# EAGLE design BlankSlate (EAGLE 7.3.0)
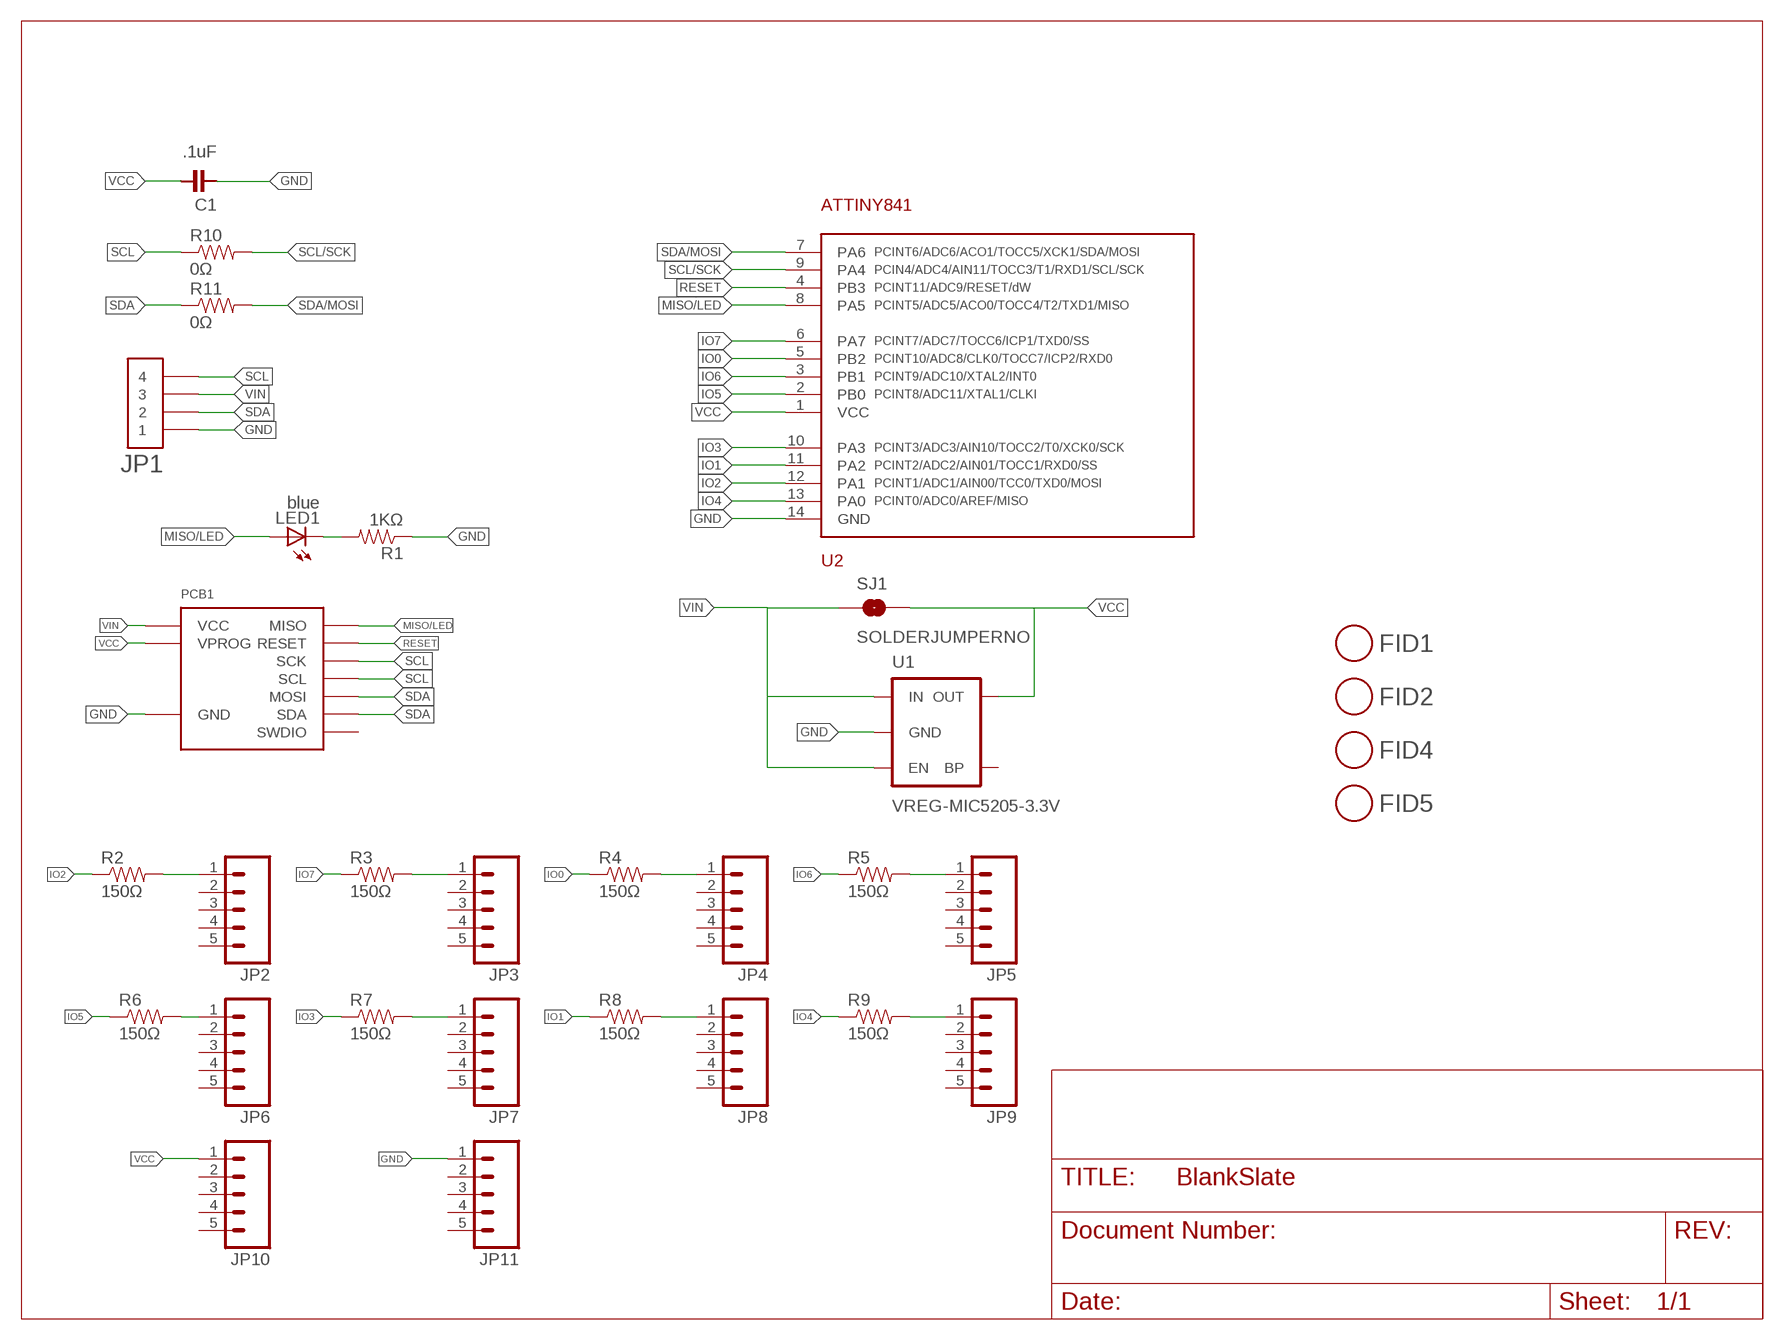
[diagram p0: schematic, sheet 1]
FRAME1 (LETTER_L): BOM: EXCLUDE

## Parts
C1  .1uF  CAPACITOR-.1UF  [0603]
FID1  FIDUCIAL  [FIDUCIAL_1MM]
FID2  FIDUCIAL  [FIDUCIAL_1MM]
FID4  FIDUCIAL  [FIDUCIAL_1MM]
FID5  FIDUCIAL  [FIDUCIAL_1MM]
JP1  HEADER-1X4-AMPMODU  [AMPMODU-4P]
JP2  M05NO_SILK  [1X05_NO_SILK]
JP3  M05NO_SILK  [1X05_NO_SILK]
JP4  M05NO_SILK  [1X05_NO_SILK]
JP5  M05NO_SILK  [1X05_NO_SILK]
JP6  M05NO_SILK  [1X05_NO_SILK]
JP7  M05NO_SILK  [1X05_NO_SILK]
JP8  M05NO_SILK  [1X05_NO_SILK]
JP9  M05NO_SILK  [1X05_NO_SILK]
JP10  M05NO_SILK  [1X05_NO_SILK]
JP11  M05NO_SILK  [1X05_NO_SILK]
LED1  blue  LED-0805-BLUE  [0805-LED]
PCB1  DEVICE-PCB  [DEVICE-PCB]
R1  1KΩ  RESISTOR-1KΩ  [0603]
R2  150Ω  RESISTOR-150Ω  [0603]
R3  150Ω  RESISTOR-150Ω  [0603]
R4  150Ω  RESISTOR-150Ω  [0603]
R5  150Ω  RESISTOR-150Ω  [0603]
R6  150Ω  RESISTOR-150Ω  [0603]
R7  150Ω  RESISTOR-150Ω  [0603]
R8  150Ω  RESISTOR-150Ω  [0603]
R9  150Ω  RESISTOR-150Ω  [0603]
R10  0Ω  RESISTOR-0Ω  [0603]
R11  0Ω  RESISTOR-0Ω  [0603]
SJ1  SOLDERJUMPERNO  [SJ_2S-NO]
U1  VREG-MIC5205-3.3V  [SOT23-5]
U2  ATTINY841  [SOIC-14]

## Nets
GND: C1.2 JP1.P$1 JP1.P$2 JP11.1 PCB1.GND R1.1 U1.2(GND) U2.14(GND)
IO0: R4.1 U2.5(PB2)
IO1: R8.1 U2.11(PA2)
IO2: R2.1 U2.12(PA1)
IO3: R7.1 U2.10(PA3)
IO4: R9.1 U2.13(PA0)
IO5: R6.1 U2.2(PB0)
IO6: R5.1 U2.3(PB1)
IO7: R3.1 U2.6(PA7)
MISO/LED: LED1.A PCB1.MISO U2.8(PA5)
N$3: JP4.1 R4.2
N$4: JP5.1 R5.2
N$5: JP7.1 R7.2
N$6: JP2.1 R2.2
N$7: JP3.1 R3.2
N$8: JP6.1 R6.2
N$9: JP9.1 R9.2
N$10: LED1.C R1.2
N$12: JP8.1 R8.2
RESET: PCB1.RESET U2.4(PB3)
SCL: JP1.P$7 JP1.P$8 PCB1.CLK(SCK) PCB1.SCL R10.1
SCL/SCK: R10.2 U2.9(PA4)
SDA: JP1.P$3 JP1.P$4 PCB1.MOSI PCB1.SDA R11.1
SDA/MOSI: R11.2 U2.7(PA6)
VCC: C1.1 JP10.1 PCB1.VPROG SJ1.2 U1.5(OUT) U2.1(VCC)
VIN: JP1.P$5 JP1.P$6 PCB1.VCC SJ1.1 U1.1(IN) U1.3(EN)
Unconnected: JP2.2 JP2.3 JP2.4 JP2.5 JP3.2 JP3.3 JP3.4 JP3.5 JP4.2 JP4.3 JP4.4 JP4.5 JP5.2 JP5.3 JP5.4 JP5.5 JP6.2 JP6.3 JP6.4 JP6.5 JP7.2 JP7.3 JP7.4 JP7.5 JP8.2 JP8.3 JP8.4 JP8.5 JP9.2 JP9.3 JP9.4 JP9.5 JP10.2 JP10.3 JP10.4 JP10.5 JP11.2 JP11.3 JP11.4 JP11.5 PCB1.SWDIO U1.4(BP)

## Library data of the parts
C1 = Modulo:CAPACITOR: Capacitor; PARTNUM: C0603C104K5RACTU
FID1 FID2 FID4 FID5 = Modulo:FIDUCIAL; BOM: EXCLUDE
JP1 = Modulo:HEADER-1X4; PARTNUM: 147721-3
JP2-JP11 = SparkFun-Connectors:M05: Header 5 Standard 5-pin 0.1" header. Use with straight break away headers (SKU : PRT-00116), right angle break away headers (PRT-00553), swiss pins (PRT-00743), machine pins (PRT-00117), and female headers (PRT-00115). Molex polarized connector foot print use with SKU : PRT-08230 with associated crimp pins and housings.; PARTNUM: EXCLUDE
LED1 = Modulo:LED: LED; PARTNUM: LTST-C171TBKT
PCB1 = Modulo:DEVICE-PCB: Modulo Footprint; PARTNUM: Blank Slate PCB
R1 = Modulo:RESISTOR: Resistor Basic schematic elements and footprints for 0603, 1206, and PTH resistors.; PARTNUM: ERJ-3EKF1001V
R2-R9 = Modulo:RESISTOR: Resistor Basic schematic elements and footprints for 0603, 1206, and PTH resistors.; PARTNUM: ERJ-3EKF1500V
R10 R11 = Modulo:RESISTOR: Resistor Basic schematic elements and footprints for 0603, 1206, and PTH resistors.; PARTNUM: ERJ-3GEY0R00V
SJ1 = SparkFun-Passives:SOLDERJUMPER: Solder Jumper Standard SMD solder jumper. Used to automate production. Two varients : Normally Open and Normally Closed are the same, but have different paste layers. NC will have a large amount of paste and should jumper during reflow.; BOM: EXCLUDE
U1 = Modulo:VREG-MIC5205: V_REG MIC5219 Standard 3.3V and 5V 150mA LDO voltage regulator in SOT-23 layout. Micrel part MIC5205. BP (by-pass) pin is used to lower output noise with 470pF cap, may be left open.; PARTNUM: MIC5205-3.3YM5 TR
U2 = Modulo:ATTINY841; PARTNUM: ATTINY841-SSUR

## Board
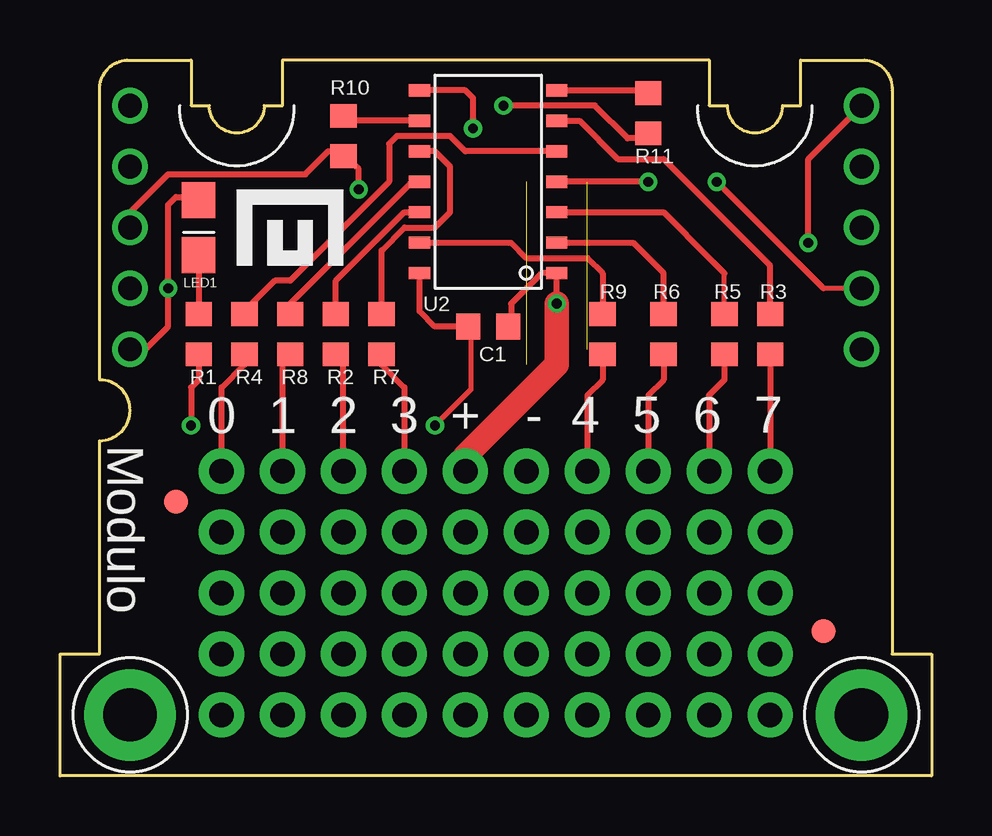
[diagram p1: board, top side]
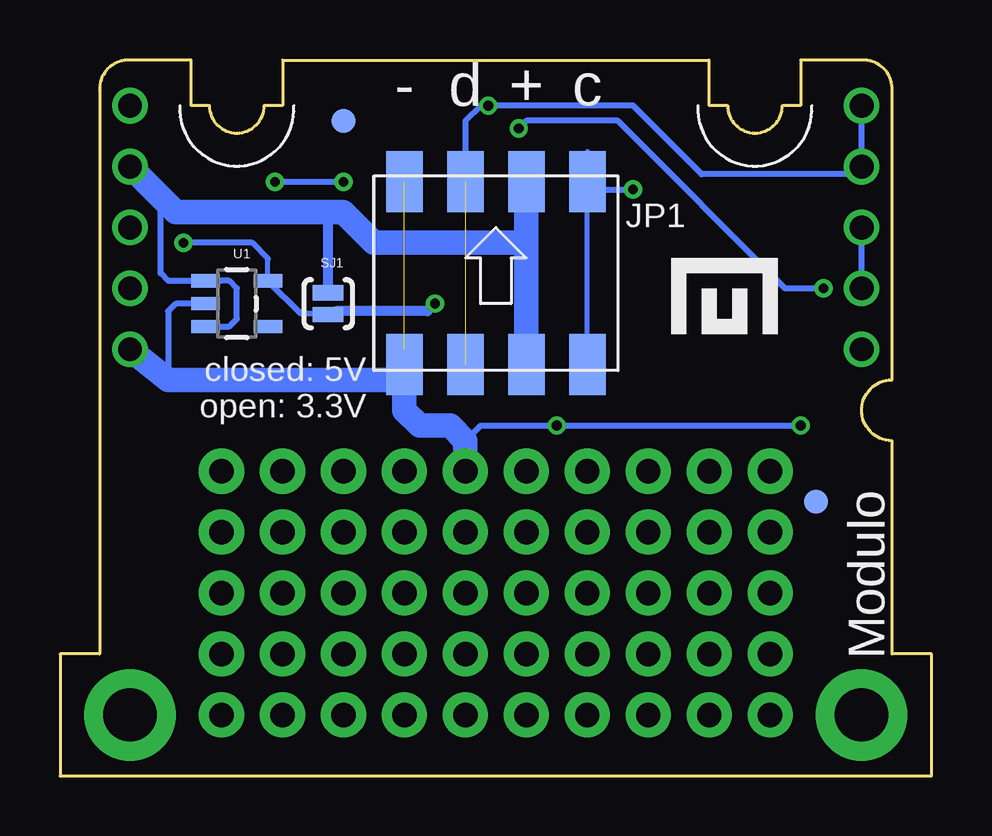
[diagram p2: board, bottom side, seen from below]

Size 36.32 x 29.84 mm. Coordinates in mm from the lower left corner, seen from the top.
Copper layers (1*16): Top 0.0356mm / dielectric 1.5011mm / Bottom 0.0356mm
Design rules "Modulo": minimum track width 6mil, minimum drill 13mil, track to track 6mil, track to pad 6mil, pad to pad 6mil, via to via 6mil, smd to smd 6mil, copper to edge 15mil, drill to drill 6mil, minimum pad ring 7mil, minimum via ring 7mil, stop-mask expansion 3mil, vias tented up to drill 25mil, thermal gap 10mil

### Footprints (pad centres in the part's own frame; a part is rotated, then mirrored left to right if it is on the bottom)
0603 = smd 0.991 x 1.092: 1 -0.838,0; 2 0.838,0
FIDUCIAL_1MM = smd 1 x 1: 1 0,0
AMPMODU-4P = smd 1.524 x 2.54: P$1 -3.81,3.81; P$2 -3.81,-3.81; P$3 -1.27,3.81; P$4 -1.27,-3.81; P$5 1.27,3.81; P$6 1.27,-3.81; P$7 3.81,3.81; P$8 3.81,-3.81
1X05_NO_SILK = drill 1.016 pad 1.88: 1 0,0; 2 2.54,0; 3 5.08,0; 4 7.62,0; 5 10.16,0
0805-LED = smd 1.397 x 1.499: A 0,-1.143; C 0,1.143
DEVICE-PCB = drill 0.991: CLK 2.54,20.32; GND 33.02,17.78; MISO 2.54,17.78; MOSI 2.54,25.4; RESET 33.02,20.32; SCL 2.54,22.86; SDA 2.54,27.94; SWDIO 33.02,22.86; VCC 33.02,25.4; VPROG 33.02,27.94 | drill 2.223 pad 3.81: P$1 2.54,2.54; P$2 33.02,2.54
SJ_2S-NO = smd 0.635 x 1.27: 1 -0.45,0; 2 0.45,0
SOT23-5 = smd 0.55 x 1.2: 1 -0.95,-1.3; 2 0,-1.3; 3 0.95,-1.3; 4 0.95,1.3; 5 -0.95,1.3
SOIC-14 = smd 0.508 x 0.889: 1 0,-3.175; 2 1.27,-3.175; 3 2.54,-3.175; 4 3.81,-3.175; 5 5.08,-3.175; 6 6.35,-3.175; 7 7.62,-3.175; 8 7.62,2.54; 9 6.35,2.54; 10 5.08,2.54; 11 3.81,2.54; 12 2.54,2.54; 13 1.27,2.54; 14 0,2.54

### Placement (x,y rotation side)
C1  17.84,18.73 180 top
FID1  31.81,6.03 90 top
FID2  4.83,11.43 0 top
FID4  24.51,27.3 0 bottom
FID5  4.83,11.43 0 bottom
JP1  18.16,20.95 0 bottom
JP2  11.81,12.7 270 bottom
JP3  29.59,12.7 270 bottom
JP4  6.73,12.7 270 bottom
JP5  27.05,12.7 270 bottom
JP6  24.51,12.7 270 bottom
JP7  14.35,12.7 270 bottom
JP8  9.27,12.7 270 bottom
JP9  21.97,12.7 270 bottom
JP10  16.89,12.7 270 bottom
JP11  19.43,12.7 270 bottom
LED1  5.78,22.86 180 top
PCB1  0.38,0 0 top
R1  5.78,18.41 90 top
R2  11.49,18.41 270 top
R3  29.59,18.41 270 top
R4  7.68,18.41 270 top
R5  27.69,18.41 270 top
R6  25.15,18.41 270 top
R7  13.4,18.41 270 top
R8  9.59,18.41 270 top
R9  22.61,18.41 270 top
R10  11.81,26.67 90 top
R11  24.51,27.62 90 top
SJ1  25.15,19.68 270 bottom
U1  28.96,19.68 270 bottom
U2  17.53,20.95 90 top
U$1  [LOGO-SMALL]  8.95,19.05 0 bottom
U$2  [LOGO-SMALL]  9.27,21.91 0 top

### Tracks (layer width: path | path; a pad name or v marks a point on that pad's centre or on a via)
GND  (via drill 0.41)  (1 unrouted)
  Top 0.203: C1.2 17.12,18.7 17.12,16.1 v15.62,14.61
  Top 0.254: C1.2 15.62,18.73 14.99,19.37 U2.14 | R1.1 5.78,16.51 5.46,16.19 v5.46,14.61
  Bottom 0.203: JP1.P$2 21.97,17.78
  Bottom 0.254: v5.46,14.61 v15.62,14.61 18.8,14.61 19.43,13.97 | U1.2 31.5,19.68 31.81,19.37 31.81,16.51
  Bottom 1.016: JP1.P$2 21.97,15.24 21.34,14.61 20.07,14.61 19.43,13.97 JP11.1 | PCB1.GND 31.81,16.51 22.29,16.51 21.97,16.83 21.97,17.78
IO0
  Top 0.203: 7.68,19.37 R4.1
  Top 0.254: U2.5 16.89,26.04 16.26,26.67 14.03,26.67 13.72,26.35 13.72,24.77 9.59,20.64 8.95,20.64 7.68,19.37
IO1
  Top 0.203: U2.11 14.67,24.77 | 9.59,19.68 R8.1
  Top 0.254: 14.67,24.77 9.59,19.68
IO2
  Top 0.254: R2.1 11.49,20.64 14.35,23.5 U2.12
IO3
  Top 0.254: R7.1 13.4,21.91 14.35,22.86 15.62,22.86 16.26,23.5 16.26,25.4 15.62,26.04 U2.10
IO4
  Top 0.254: U2.13 18.8,22.23 19.43,21.59 21.97,21.59 22.61,20.95 R9.1
IO5
  Top 0.254: U2.2 23.88,22.23 25.15,20.95 R6.1
IO6
  Top 0.203: R5.1 27.69,20.95
  Top 0.254: U2.3 25.15,23.5 27.05,21.59 27.69,20.95
IO7
  Top 0.254: U2.6 21.65,27.3 23.24,25.72 25.15,25.72 29.59,21.27 R3.1
MISO/LED  (via drill 0.41)
  Top 0.203: 5.65,24.13 LED1.A
  Top 0.254: v17.21,26.99 17.21,28.26 16.89,28.57 U2.8 | PCB1.MISO 3.56,17.78 4.51,18.73 v4.51,20.32 4.51,23.81 4.83,24.13 5.65,24.13
  Bottom 0.254: v4.51,20.32 6.1,20.32 13.08,27.3 16.89,27.3 v17.21,26.99
N$3
  Top 0.203: 7.68,17.14 R4.2
  Top 0.254: JP4.1 6.73,16.19 7.68,17.14
N$4
  Top 0.254: R5.2 27.69,16.51 27.05,15.88 JP5.1
N$5
  Top 0.254: R7.2 13.4,17.14 14.35,16.19 JP7.1
N$6
  Top 0.203: 11.81,17.46 11.49,17.78 R2.2
  Top 0.254: JP2.1 11.81,17.46
N$7
  Top 0.254: R3.2 JP3.1
N$8
  Top 0.254: R6.2 25.15,16.51 24.51,15.88 JP6.1
N$9
  Top 0.254: R9.2 22.61,16.51 21.97,15.88 JP9.1
N$10
  Top 0.254: LED1.C R1.2
N$12
  Top 0.203: 9.27,17.14 9.59,17.46 R8.2
  Top 0.254: JP8.1 9.27,17.14
RESET  (via drill 0.41)
  Top 0.203: PCB1.RESET 31.81,20.32
  Top 0.254: 31.81,20.32 v27.37,24.77 | v24.51,24.77 U2.4
  Bottom 0.254: v27.37,24.77 v24.51,24.77
SCL  (via drill 0.41)
  Top 0.203: 11.72,26.04 R10.1
  Top 0.254: v12.45,24.45 12.45,25.31 R10.1 | 11.72,26.04 11.18,26.04 10.22,25.08 4.51,25.08 2.92,23.5 PCB1.SCL
  Bottom 0.203: JP1.P$7 14.03,24.45 | JP1.P$8 JP1.P$7 | JP1.P$7 14.35,26.04
  Bottom 0.254: 14.03,24.45 v12.45,24.45 | PCB1.CLK PCB1.SCL
SCL/SCK
  Top 0.203: 12.22,27.3 R10.2 11.81,27.39
  Top 0.254: U2.9 12.22,27.3
SDA  (via drill 0.41)  (1 unrouted)
  Top 0.254: R11.1 24.51,26.67 24.42,26.58 23.65,26.58 22.29,27.94 v18.48,27.94
  Bottom 0.254: JP1.P$3 19.43,27.3 18.8,27.94 v18.48,27.94 12.45,27.94 9.59,25.08 3.24,25.08 PCB1.MOSI PCB1.SDA
SDA/MOSI
  Top 0.254: U2.7 23.97,28.57 R11.2
VCC  (via drill 0.41)
  Top 0.203: 18.8,18.85 C1.1
  Top 0.254: v20.7,19.68 U2.1 20.07,20.95 18.8,19.68 18.8,18.85 | v31.18,22.23 31.18,25.72 PCB1.VPROG
  Top 1.016: JP10.1 16.89,13.34 20.7,17.14 v20.7,19.68
  Bottom 0.203: U1.5 27.66,21.56
  Bottom 0.254: SJ1.2 26.29,19.27 U1.5 | 27.66,21.56 28.32,22.23 v31.18,22.23
  Bottom 0.406: v20.7,19.68 21.02,19.37 24.83,19.37 SJ1.2
VIN
  Bottom 0.203: JP1.P$5 16.89,24.45 | 16.89,18.41 16.89,17.78 JP1.P$6 16.57,17.46 | 30.26,23.46 30.23,23.5 | 29.62,20.64 U1.1 | 32.13,23.5 31.81,23.81
  Bottom 0.254: U1.3 29.27,18.73 28.96,19.05 28.96,20.32 29.27,20.64 29.62,20.64 | U1.1 31.81,20.64 32.13,20.95 32.13,23.5
  Bottom 0.406: SJ1.1 25.15,23.5
  Bottom 1.016: PCB1.VCC 31.81,23.81 31.5,23.5 30.23,23.5 25.15,23.5 24.51,23.5 23.24,22.23 16.89,22.23 | 16.89,22.23 16.89,17.78 | 16.89,22.23 JP1.P$5

### Text on the board
tPlace: 0 | 1 | 2 | 3 | + | - | 4 | 5 | 6 | 7
bPlace: closed: 5V / open: 3.3V